# EasyEDA schematic Prática-07.json
TITLE: Sheet_1; REV: 1.0; Date: 2020-10-14; Sheet: 1/1; Company: Your Company
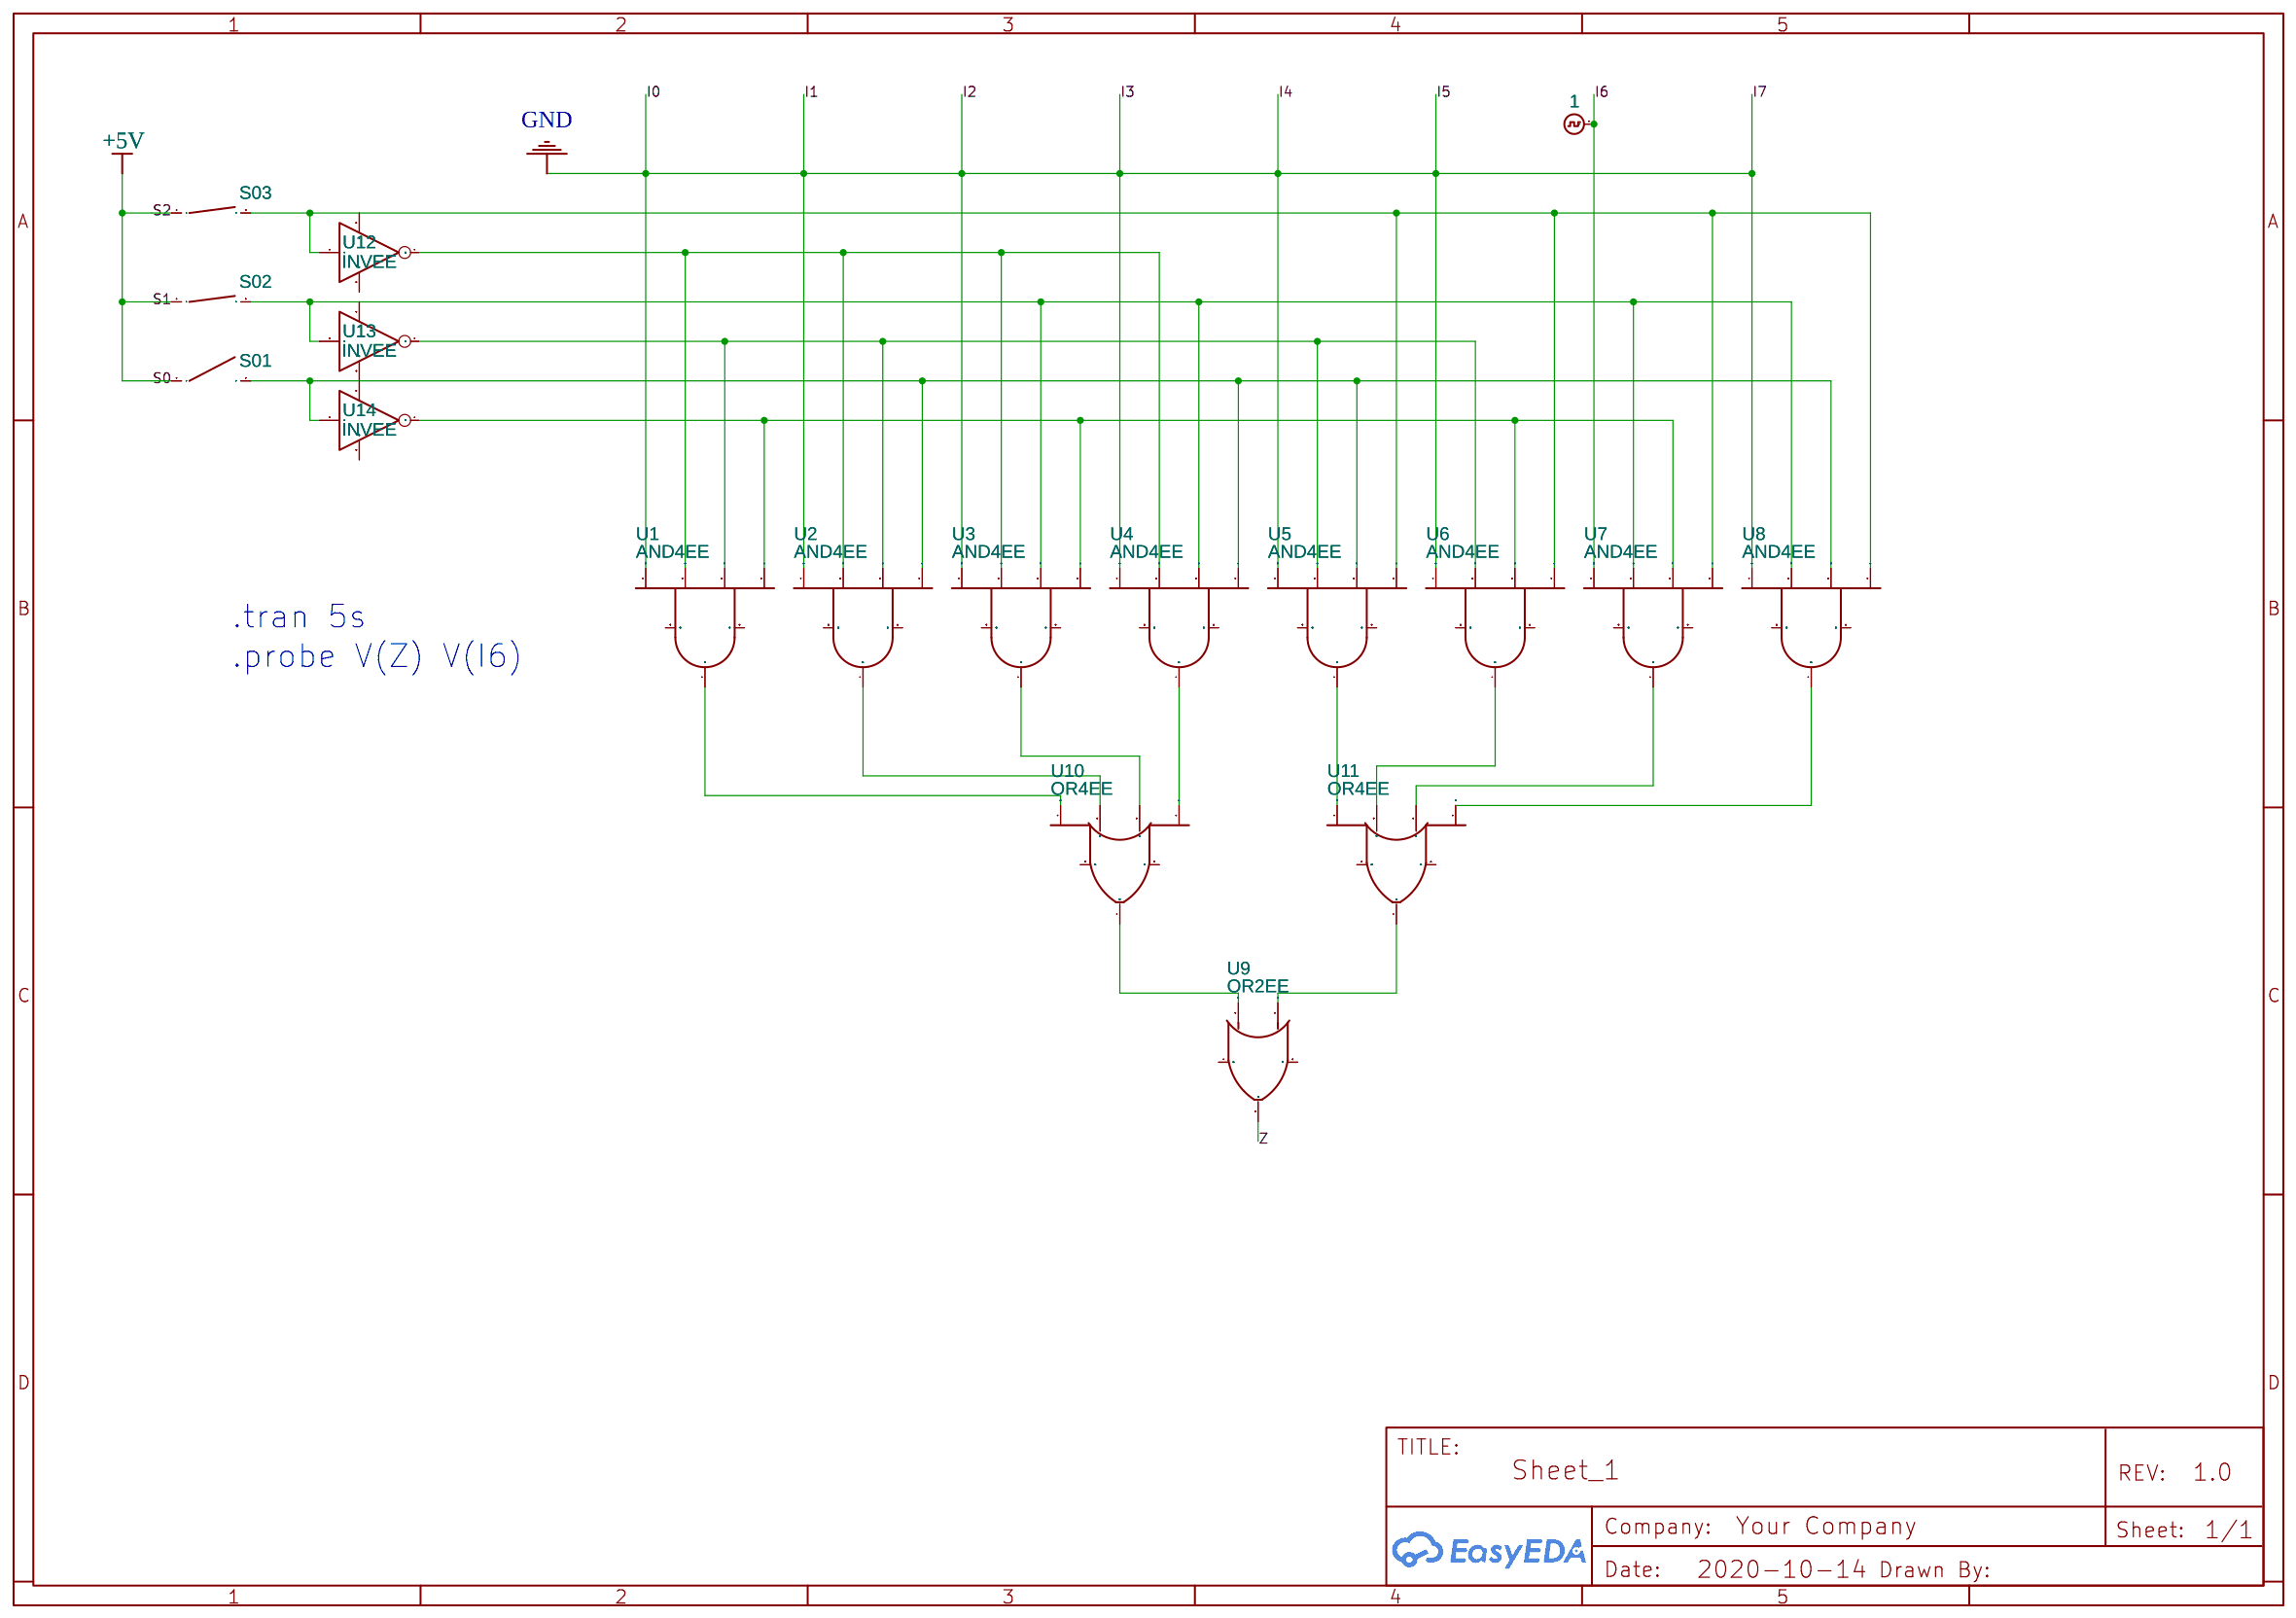
[diagram p0: schematic sheet]

## Parts
S01  SPST_Open
S02  SPST_Open
S03  SPST_Open
U1  AND4EE
U2  AND4EE
U3  AND4EE
U4  AND4EE
U5  AND4EE
U6  AND4EE
U7  AND4EE
U8  AND4EE
U9  OR2EE
U10  OR4EE
U11  OR4EE
U12  INVEE
U13  INVEE
U14  INVEE
U15  1

## Library data of the parts
S01 = SPST: catid: 20; State: Open; Contributor: EasyEDA; NameDisplay: 0
S02 S03 = SPST: catid: 20; State: Close; Contributor: EasyEDA; NameDisplay: 0
U1-U14 = LOGIC: Contributor: EasyEDA
U15 = DIGITALCLOCK: Contributor: EasyEDA; PreDisplay: 0

## Nets
+5V: S01.1 S02.1 S03.1
GND: U1.4(IND) U2.4(IND) U3.4(IND) U4.4(IND) U5.4(IND) U6.4(IND) U8.4(IND)
I6: U7.4(IND) U15.1
Z: U9.5(OUT)
Net-(S01-2): S01.2 U2.1(INA) U4.1(INA) U5.2(INB) U8.2(INB) U14.1(IN)
Net-(S02-2): S02.2 U3.2(INB) U4.2(INB) U7.3(INC) U8.3(INC) U13.1(IN)
Net-(S03-2): S03.2 U5.1(INA) U6.1(INA) U7.1(INA) U8.1(INA) U12.1(IN)
Net-(U1-1): U1.1(INA) U3.1(INA) U6.2(INB) U7.2(INB) U14.4(OUT)
Net-(U1-2): U1.2(INB) U2.2(INB) U5.3(INC) U6.3(INC) U13.4(OUT)
Net-(U1-3): U1.3(INC) U2.3(INC) U3.3(INC) U4.3(INC) U12.4(OUT)
Net-(U1-7): U1.7(OUT) U10.4(IND)
Net-(U2-7): U2.7(OUT) U10.3(INC)
Net-(U3-7): U3.7(OUT) U10.2(INB)
Net-(U4-7): U4.7(OUT) U10.1(INA)
Net-(U5-7): U5.7(OUT) U11.4(IND)
Net-(U6-7): U6.7(OUT) U11.3(INC)
Net-(U7-7): U7.7(OUT) U11.2(INB)
Net-(U8-7): U8.7(OUT) U11.1(INA)
Net-(U9-1): U9.1(INA) U11.7(OUT)
Net-(U9-2): U9.2(INB) U10.7(OUT)
Net-(U13-3): U13.3(GND) U14.2(VDD)

Not connected (* = marked no-connect by the designer): U1 5(VDD) 6(GND); U2 5(VDD) 6(GND); U3 5(VDD) 6(GND); U4 5(VDD) 6(GND); U5 5(VDD) 6(GND); U6 5(VDD) 6(GND); U7 5(VDD) 6(GND); U8 5(VDD) 6(GND); U9 3(VDD) 4(GND); U10 5(VDD) 6(GND); U11 5(VDD) 6(GND); U12 2(VDD) 3(GND); U13 2(VDD); U14 3(GND)

## Notes on the sheet
- .tran 5s
- .probe V(Z) V(I6)
